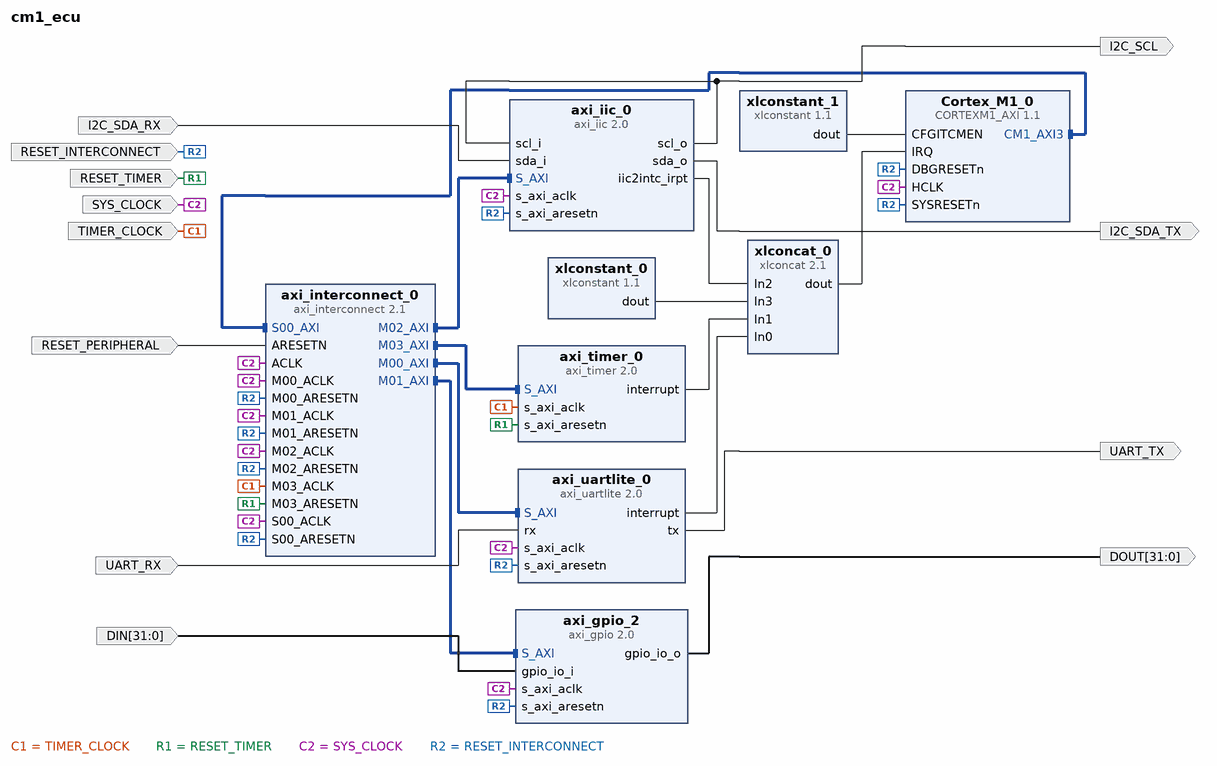
[diagram p0: block diagram of the top level]
# Vivado block design cm1_ecu, xc7z020clg484-1, Vivado 2018.3
create_bd_design cm1_ecu

create_bd_port -dir O -from 31 -to 0 DOUT
create_bd_port -dir O I2C_SCL
create_bd_port -dir I I2C_SDA_RX
create_bd_port -dir O I2C_SDA_TX
create_bd_port -dir I -type rst RESET_INTERCONNECT
set_property -dict {CONFIG.POLARITY ACTIVE_LOW} [get_bd_ports RESET_INTERCONNECT]
create_bd_port -dir I -type rst RESET_PERIPHERAL
set_property -dict {CONFIG.POLARITY ACTIVE_LOW} [get_bd_ports RESET_PERIPHERAL]
create_bd_port -dir I -type rst RESET_TIMER
set_property -dict {CONFIG.POLARITY ACTIVE_LOW} [get_bd_ports RESET_TIMER]
create_bd_port -dir I -type clk SYS_CLOCK
set_property -dict {CONFIG.FREQ_HZ 100000000 CONFIG.PHASE 0.000} [get_bd_ports SYS_CLOCK]
create_bd_port -dir I -type clk TIMER_CLOCK
set_property -dict {CONFIG.FREQ_HZ 8000000} [get_bd_ports TIMER_CLOCK]
create_bd_port -dir I UART_RX
create_bd_port -dir O UART_TX
create_bd_port -dir I -from 31 -to 0 DIN

create_bd_cell -type ip -vlnv xilinx.com:ip:axi_gpio:2.0 axi_gpio_2
set_property -dict [list \
  CONFIG.C_ALL_OUTPUTS 0 \
  CONFIG.C_DOUT_DEFAULT 0x00000000 \
  CONFIG.C_GPIO_WIDTH 32 \
  CONFIG.C_TRI_DEFAULT 0xFFFFFF00 \
  CONFIG.GPIO_BOARD_INTERFACE Custom \
  CONFIG.USE_BOARD_FLOW true \
] [get_bd_cells axi_gpio_2]
create_bd_cell -type ip -vlnv xilinx.com:ip:axi_iic:2.0 axi_iic_0
create_bd_cell -type ip -vlnv xilinx.com:ip:axi_interconnect:2.1 axi_interconnect_0
set_property -dict [list \
  CONFIG.ENABLE_ADVANCED_OPTIONS 1 \
  CONFIG.ENABLE_PROTOCOL_CHECKERS 0 \
  CONFIG.M00_HAS_DATA_FIFO 0 \
  CONFIG.M00_HAS_REGSLICE 0 \
  CONFIG.M00_SECURE 0 \
  CONFIG.M01_HAS_DATA_FIFO 0 \
  CONFIG.M01_HAS_REGSLICE 0 \
  CONFIG.M01_SECURE 0 \
  CONFIG.M02_HAS_REGSLICE 0 \
  CONFIG.M02_SECURE 0 \
  CONFIG.M03_HAS_REGSLICE 0 \
  CONFIG.M04_HAS_REGSLICE 0 \
  CONFIG.M05_HAS_REGSLICE 0 \
  CONFIG.NUM_MI 4 \
  CONFIG.NUM_SI 1 \
  CONFIG.S00_HAS_DATA_FIFO 0 \
  CONFIG.S00_HAS_REGSLICE 3 \
  CONFIG.S01_HAS_DATA_FIFO 1 \
  CONFIG.S01_HAS_REGSLICE 3 \
  CONFIG.STRATEGY 0 \
  CONFIG.SYNCHRONIZATION_STAGES 3 \
  CONFIG.XBAR_DATA_WIDTH 32 \
] [get_bd_cells axi_interconnect_0]
create_bd_cell -type ip -vlnv xilinx.com:ip:axi_timer:2.0 axi_timer_0
set_property -dict {CONFIG.enable_timer2 0} [get_bd_cells axi_timer_0]
create_bd_cell -type ip -vlnv xilinx.com:ip:axi_uartlite:2.0 axi_uartlite_0
set_property -dict [list \
  CONFIG.C_BAUDRATE 9600 \
  CONFIG.C_S_AXI_ACLK_FREQ_HZ 100000000 \
  CONFIG.UARTLITE_BOARD_INTERFACE Custom \
  CONFIG.USE_BOARD_FLOW true \
] [get_bd_cells axi_uartlite_0]
create_bd_cell -type ip -vlnv xilinx.com:ip:xlconcat:2.1 xlconcat_0
set_property -dict [list \
  CONFIG.IN0_WIDTH 1 \
  CONFIG.IN1_WIDTH 1 \
  CONFIG.IN2_WIDTH 1 \
  CONFIG.IN3_WIDTH 29 \
  CONFIG.IN7_WIDTH 24 \
  CONFIG.NUM_PORTS 4 \
] [get_bd_cells xlconcat_0]
create_bd_cell -type ip -vlnv xilinx.com:ip:xlconstant:1.1 xlconstant_0
set_property -dict {CONFIG.CONST_VAL 0 CONFIG.CONST_WIDTH 29} [get_bd_cells xlconstant_0]
create_bd_cell -type ip -vlnv xilinx.com:ip:xlconstant:1.1 xlconstant_1
set_property -dict {CONFIG.CONST_WIDTH 2} [get_bd_cells xlconstant_1]
create_bd_cell -type ip -vlnv arm.com:CortexM:CORTEXM1_AXI:1.1 Cortex_M1_0
set_property -dict [list \
  CONFIG.DEBUG_SEL 1 \
  CONFIG.DTCM_SIZE {"0110"} \
  CONFIG.ITCM_INIT_FILE bram_a7.hex \
  CONFIG.ITCM_INIT_RAM true \
  CONFIG.ITCM_SIZE {"0110"} \
  CONFIG.NUM_IRQ 32 \
  CONFIG.SMALL_DEBUG true \
] [get_bd_cells Cortex_M1_0]

# ---- connections ----

connect_bd_intf_net [get_bd_intf_pins axi_interconnect_0/M02_AXI] [get_bd_intf_pins axi_iic_0/S_AXI]
connect_bd_intf_net [get_bd_intf_pins axi_uartlite_0/S_AXI] [get_bd_intf_pins axi_interconnect_0/M00_AXI]
connect_bd_intf_net [get_bd_intf_pins axi_interconnect_0/M03_AXI] [get_bd_intf_pins axi_timer_0/S_AXI]
connect_bd_intf_net [get_bd_intf_pins Cortex_M1_0/CM1_AXI3] [get_bd_intf_pins axi_interconnect_0/S00_AXI]
connect_bd_intf_net [get_bd_intf_pins axi_interconnect_0/M01_AXI] [get_bd_intf_pins axi_gpio_2/S_AXI]
connect_bd_net [get_bd_ports I2C_SDA_RX] [get_bd_pins axi_iic_0/sda_i]
connect_bd_net -net M04_ACLK_1 [get_bd_ports TIMER_CLOCK] [get_bd_pins axi_interconnect_0/M03_ACLK] [get_bd_pins axi_timer_0/s_axi_aclk]
connect_bd_net -net M04_ARESETN_1 [get_bd_ports RESET_TIMER] [get_bd_pins axi_interconnect_0/M03_ARESETN] [get_bd_pins axi_timer_0/s_axi_aresetn]
connect_bd_net [get_bd_ports UART_RX] [get_bd_pins axi_uartlite_0/rx]
connect_bd_net [get_bd_pins axi_iic_0/iic2intc_irpt] [get_bd_pins xlconcat_0/In2]
connect_bd_net [get_bd_pins axi_iic_0/scl_o] [get_bd_ports I2C_SCL] [get_bd_pins axi_iic_0/scl_i]
connect_bd_net [get_bd_pins axi_iic_0/sda_o] [get_bd_ports I2C_SDA_TX]
connect_bd_net [get_bd_pins axi_timer_0/interrupt] [get_bd_pins xlconcat_0/In1]
connect_bd_net [get_bd_pins axi_uartlite_0/interrupt] [get_bd_pins xlconcat_0/In0]
connect_bd_net [get_bd_pins axi_uartlite_0/tx] [get_bd_ports UART_TX]
connect_bd_net -net clk_wiz_0_clk_out1 [get_bd_ports SYS_CLOCK] \
  [get_bd_pins axi_gpio_2/s_axi_aclk] [get_bd_pins axi_iic_0/s_axi_aclk] [get_bd_pins axi_interconnect_0/ACLK] \
  [get_bd_pins axi_interconnect_0/S00_ACLK] [get_bd_pins axi_interconnect_0/M00_ACLK] \
  [get_bd_pins axi_interconnect_0/M01_ACLK] [get_bd_pins axi_interconnect_0/M02_ACLK] [get_bd_pins axi_uartlite_0/s_axi_aclk] \
  [get_bd_pins Cortex_M1_0/HCLK]
connect_bd_net -net reset_0_1 [get_bd_ports RESET_INTERCONNECT] \
  [get_bd_pins axi_gpio_2/s_axi_aresetn] [get_bd_pins axi_iic_0/s_axi_aresetn] [get_bd_pins axi_interconnect_0/S00_ARESETN] \
  [get_bd_pins axi_interconnect_0/M00_ARESETN] [get_bd_pins axi_interconnect_0/M01_ARESETN] \
  [get_bd_pins axi_interconnect_0/M02_ARESETN] [get_bd_pins axi_uartlite_0/s_axi_aresetn] [get_bd_pins Cortex_M1_0/SYSRESETn] \
  [get_bd_pins Cortex_M1_0/DBGRESETn]
connect_bd_net -net reset_peripherial_1 [get_bd_ports RESET_PERIPHERAL] [get_bd_pins axi_interconnect_0/ARESETN]
connect_bd_net [get_bd_pins xlconcat_0/dout] [get_bd_pins Cortex_M1_0/IRQ]
connect_bd_net [get_bd_pins xlconstant_0/dout] [get_bd_pins xlconcat_0/In3]
connect_bd_net [get_bd_pins xlconstant_1/dout] [get_bd_pins Cortex_M1_0/CFGITCMEN]
connect_bd_net [get_bd_pins axi_gpio_2/gpio_io_o] [get_bd_ports DOUT]
connect_bd_net [get_bd_ports DIN] [get_bd_pins axi_gpio_2/gpio_io_i]

# ---- address map ----
assign_bd_address -offset 0x40000000 -range 64K -target_address_space [get_bd_addr_spaces Cortex_M1_0/CM1_AXI3] [get_bd_addr_segs axi_gpio_2/S_AXI/Reg]
assign_bd_address -offset 0x40100000 -range 64K -target_address_space [get_bd_addr_spaces Cortex_M1_0/CM1_AXI3] [get_bd_addr_segs axi_uartlite_0/S_AXI/Reg]
assign_bd_address -offset 0x40800000 -range 64K -target_address_space [get_bd_addr_spaces Cortex_M1_0/CM1_AXI3] [get_bd_addr_segs axi_iic_0/S_AXI/Reg]
assign_bd_address -offset 0x41C00000 -range 64K -target_address_space [get_bd_addr_spaces Cortex_M1_0/CM1_AXI3] [get_bd_addr_segs axi_timer_0/S_AXI/Reg]

validate_bd_design
save_bd_design
